# Altium schematic sheet AudioAmp.SchDoc: Audio Amplifier
size Letter; DocumentNumber: 5; Revision: 1; SheetNumber: 5; SheetTotal: 6
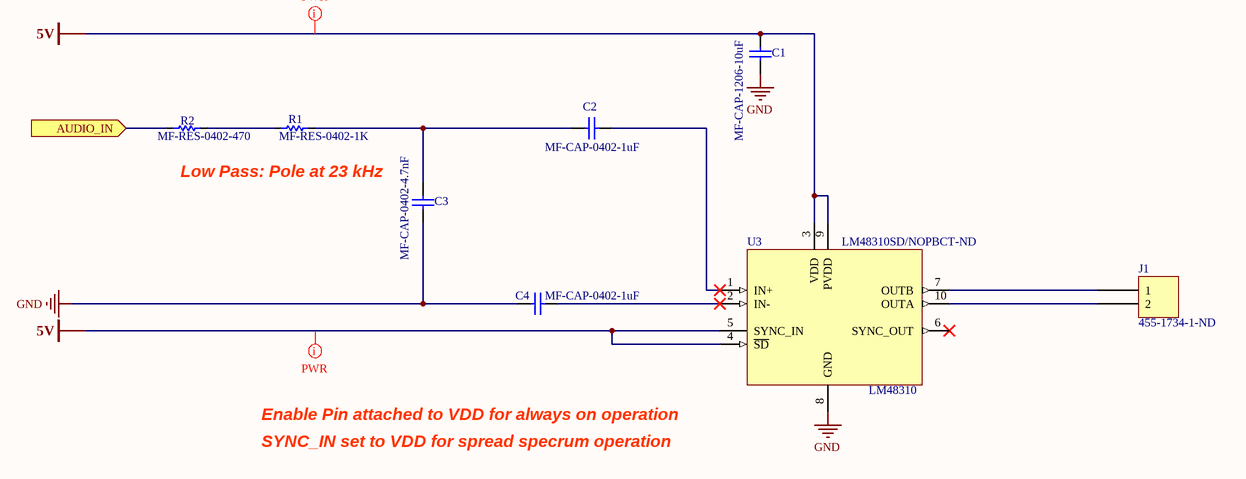
[diagram p0: AudioAmp.SchDoc]

## Parts
C1  MF-CAP-1206-10uF  [C1206L]
C2  MF-CAP-0402-1uF  [C0402N]
C3  MF-CAP-0402-4.7nF  [C0402L]
C4  MF-CAP-0402-1uF  [C0402N]
J1  455-1734-1-ND  [JST B2B-PH-SM4]
R1  MF-RES-0402-1K  [R0402L]
R2  MF-RES-0402-470  [R0402L]
U3  LM48310  Supplier Part Number 1: LM48310SD/NOPBCT-ND  [LM48310_l]

## Ports
AUDIO_IN (in)

## Nets
5V: C1.1 U3.3(VDD) U3.4(~{SD}) U3.5(SYNC_IN) U3.9(PVDD)
GND: C1.2 C3.1 C4.2 U3.8(GND)
AUDIO_IN: R2.1 ; port AUDIO_IN
NetC2_1: C2.1 U3.1(IN+)
NetC2_2: C2.2 C3.2 R1.2
NetC4_1: C4.1 U3.2(IN-)
NetJ1_1: J1.1 U3.7(OUTB)
NetJ1_2: J1.2 U3.10(OUTA)
NetR1_1: R1.1 R2.2

Not connected (* = marked no-connect by the designer): U3 6(SYNC_OUT)*

## Layout directives
net class PWR: 5V

## Notes on the sheet
- Low Pass: Pole at 23 kHz
- Enable Pin attached to VDD for always on operation
- SYNC_IN set to VDD for spread specrum operation
- Title
- Size:
- Date:
- Letter
- Number:
- Time:
- Revision:
- Sheet
- of
- File:

## Library data of the parts
C1 = CAPACITOR_NP: HOUSEPART: YES; POPULATE: 1; TOLERANCE: 10%; VOLTAGE: 16V; VALUE: 10uF; LibraryName: MF_Passives; DeviceSetName: CAPACITOR_NP; MF_PARTNUM: MF-CAP-1206-10uF; Supplier 1: Digi-Key; Supplier Part Number 1: 445-1426-1-ND
C2 C4 = CAPACITOR_NP: HOUSEPART: YES; POPULATE: 1; TOLERANCE: 10%; VOLTAGE: 16V; Capacitance: 1uF; LibraryName: MF_Passives; DeviceSetName: CAPACITOR_NP; MF_PARTNUM: MF-CAP-0402-1uF; Supplier 1: Digi-Key; Supplier Part Number 1: 490-10453-1-ND
C3 = CAPACITOR_NP: HOUSEPART: YES; POPULATE: 1; VALUE: 4.7nF; LibraryName: MF_Passives; DeviceSetName: CAPACITOR_NP; MF_PARTNUM: MF-CAP-0402-4.7nF
J1 = 2 Pin: Supplier 1: Digi-Key; Supplier Part Number 1: 455-1734-1-ND
R1 = RESISTOR: HOUSEPART: YES; POPULATE: 1; VOLTAGE: 50 V; WATTAGE: 100mW; VALUE: 1K; SymbolName_1: RESISTOR; LibraryName: MF_Passives; DeviceSetName: RESISTOR; MF_PARTNUM: MF-RES-0402-1K
R2 = RESISTOR: HOUSEPART: YES; POPULATE: 1; TOLERANCE: 5%; VOLTAGE: 50V; WATTAGE: 100mW; SymbolName_1: RESISTOR; LibraryName: MF_Passives; DeviceSetName: RESISTOR; MF_PARTNUM: MF-RES-0402-470
U3 = LM48310: Supplier 1: Digi-Key